# Altium schematic sheet EncoderBoard2020.SchDoc
size A4
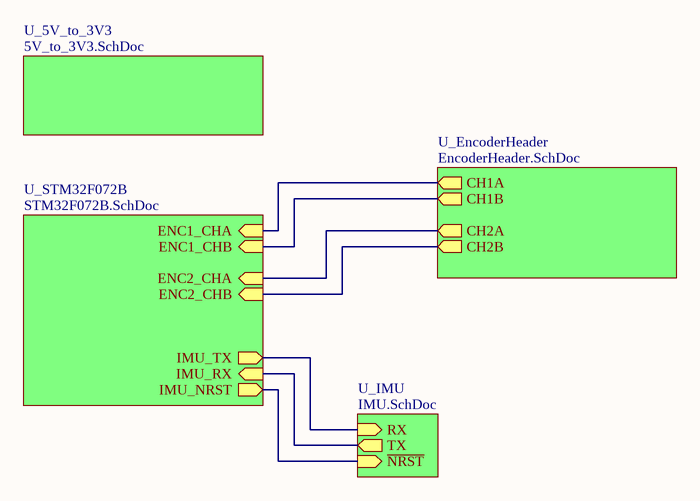
[diagram p0: EncoderBoard2020.SchDoc]

## Sub-sheets
U_5V_to_3V3 = 5V_to_3V3.SchDoc: no entries
U_EncoderHeader = EncoderHeader.SchDoc: CH1B (out), CH1A (out), CH2B (out), CH2A (out)
U_IMU = IMU.SchDoc: TX (out), RX (in), ~{NRST} (in)
U_STM32F072B = STM32F072B.SchDoc: ENC1_CHA (in), ENC1_CHB (in), ENC2_CHA (in), ENC2_CHB (in), IMU_NRST (out), IMU_RX (in), IMU_TX (out)

## Nets
(unnamed): sheet U_STM32F072B/ENC1_CHA, sheet U_EncoderHeader/CH1A
(unnamed): sheet U_STM32F072B/ENC1_CHB, sheet U_EncoderHeader/CH1B
(unnamed): sheet U_STM32F072B/ENC2_CHA, sheet U_EncoderHeader/CH2A
(unnamed): sheet U_STM32F072B/ENC2_CHB, sheet U_EncoderHeader/CH2B
(unnamed): sheet U_STM32F072B/IMU_NRST, sheet U_IMU/~{NRST}
(unnamed): sheet U_STM32F072B/IMU_RX, sheet U_IMU/TX
(unnamed): sheet U_STM32F072B/IMU_TX, sheet U_IMU/RX